# Altium schematic sheet MCU.SchDoc
size A4; SheetNumber: 3; SheetTotal: 6
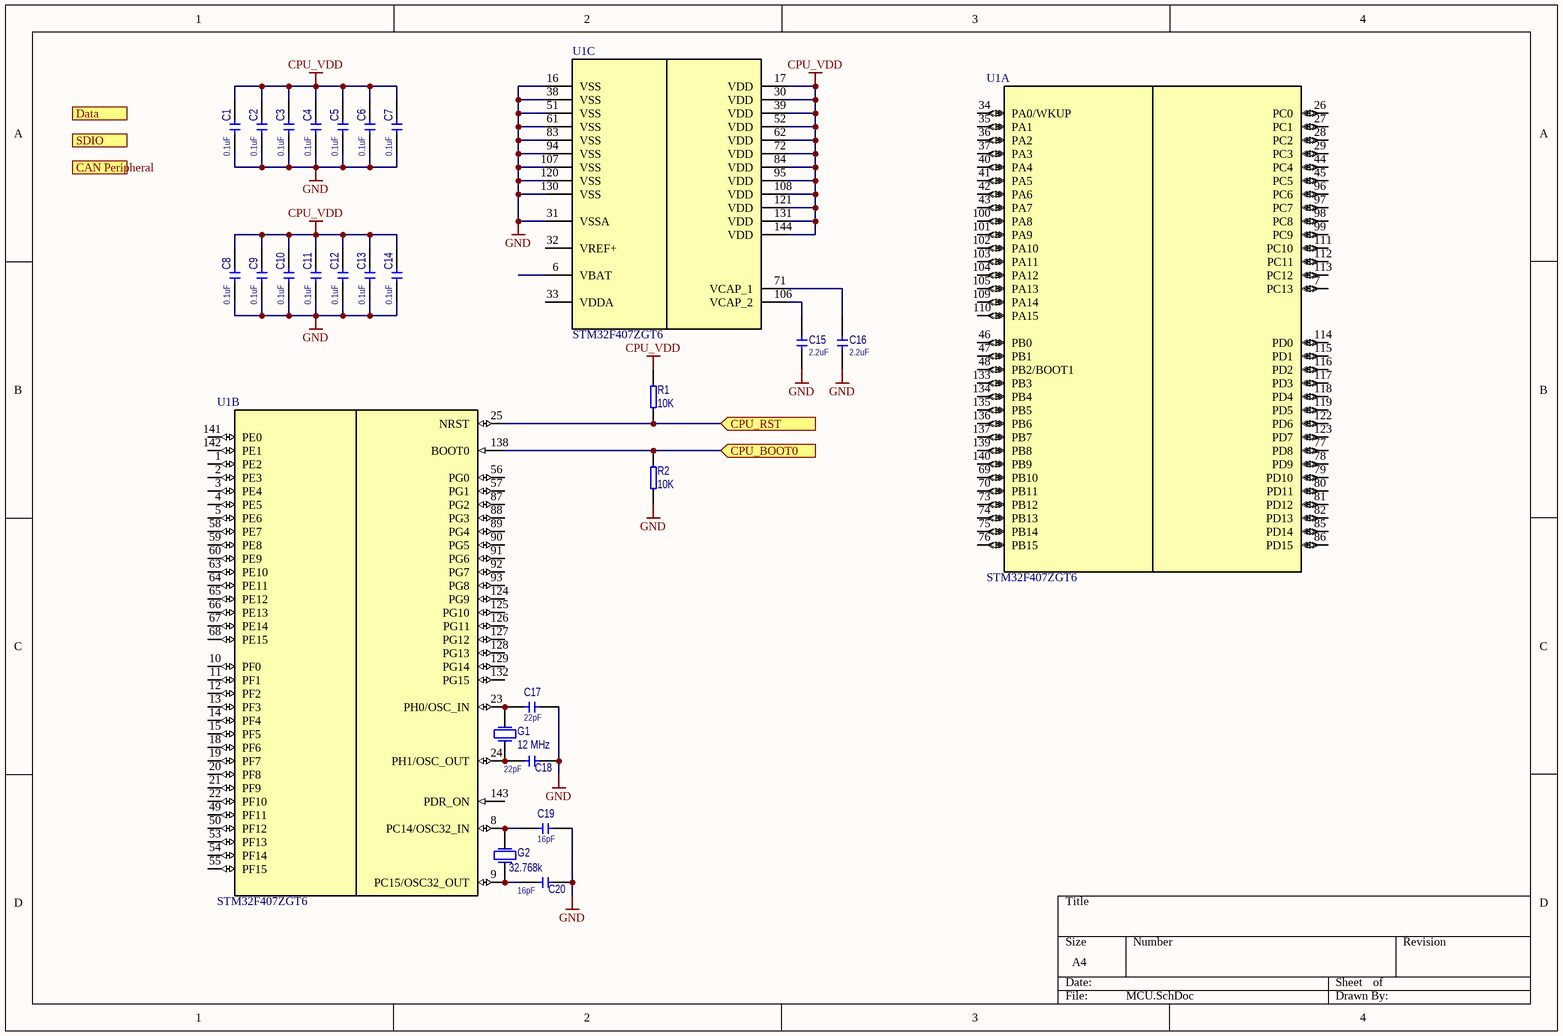
[diagram p0: MCU.SchDoc]

## Parts
C1  value 0.1uF  [CERCAP 0603]
C2  value 0.1uF  [CERCAP 0603]
C3  value 0.1uF  [CERCAP 0603]
C4  value 0.1uF  [CERCAP 0603]
C5  value 0.1uF  [CERCAP 0603]
C6  value 0.1uF  [CERCAP 0603]
C7  value 0.1uF  [CERCAP 0603]
C8  value 0.1uF  [CERCAP 0603]
C9  value 0.1uF  [CERCAP 0603]
C10  value 0.1uF  [CERCAP 0603]
C11  value 0.1uF  [CERCAP 0603]
C12  value 0.1uF  [CERCAP 0603]
C13  value 0.1uF  [CERCAP 0603]
C14  value 0.1uF  [CERCAP 0603]
C15  value 2.2uF  [CERCAP 0603]
C16  value 2.2uF  [CERCAP 0603]
C17  value 22pF  [CERCAP 0402]
C18  value 22pF  [CERCAP 0402]
C19  value 16pF  [CERCAP 0402]
C20  value 16pF  [CERCAP 0402]
G1  value 12 MHz  [3225]
G2  value 32.768k  [1210]
R1  value 10K  [RES 0402]
R2  value 10K  [RES 0402]
U1  STM32F407ZGT6  [LQFP-144]  (parts A,B,C of 3)

## Ports
CAN Peripheral, CPU_BOOT0 (in), CPU_RST (in), Data, SDIO

## Nets
CPU_VDD: C1.1 C2.1 C3.1 C4.1 C5.1 C6.1 C7.1 C8.1 C9.1 C10.1 C11.1 C12.1 C13.1 C14.1 R1.1 U1.17(VDD) U1.30(VDD) U1.39(VDD) U1.52(VDD) U1.62(VDD) U1.72(VDD) U1.84(VDD) U1.95(VDD) U1.108(VDD) U1.121(VDD) U1.131(VDD) U1.144(VDD)
GND: C1.2 C2.2 C3.2 C4.2 C5.2 C6.2 C7.2 C8.2 C9.2 C10.2 C11.2 C12.2 C13.2 C14.2 C15.2 C16.2 C17.2 C18.2 C19.2 C20.2 R2.1 U1.16(VSS) U1.31(VSSA) U1.38(VSS) U1.51(VSS) U1.61(VSS) U1.83(VSS) U1.94(VSS) U1.107(VSS) U1.120(VSS) U1.130(VSS)
CPU_BOOT0: R2.2 U1.138(BOOT0) ; port CPU_BOOT0
CPU_RST: R1.2 U1.25(NRST) ; port CPU_RST
NetC15_1: C15.1 U1.106(VCAP_2)
NetC16_1: C16.1 U1.71(VCAP_1)
NetC17_1: C17.1 G1.1 U1.23(PH0/OSC_IN)
NetC18_1: C18.1 G1.2 U1.24(PH1/OSC_OUT)
NetC19_1: C19.1 G2.1 U1.8(PC14/OSC32_IN)
NetC20_1: C20.1 G2.2 U1.9(PC15/OSC32_OUT)

Not connected (* = marked no-connect by the designer): U1 1(PE2) 2(PE3) 3(PE4) 4(PE5) 5(PE6) 6(VBAT) 7(PC13) 10(PF0) 11(PF1) 12(PF2) 13(PF3) 14(PF4) 15(PF5) 18(PF6) 19(PF7) 20(PF8) 21(PF9) 22(PF10) 26(PC0) 27(PC1) 28(PC2) 29(PC3) 32(VREF+) 33(VDDA) 34(PA0/WKUP) 35(PA1) 36(PA2) 37(PA3) 40(PA4) 41(PA5) 42(PA6) 43(PA7) 44(PC4) 45(PC5) 46(PB0) 47(PB1) 48(PB2/BOOT1) 49(PF11) 50(PF12) 53(PF13) 54(PF14) 55(PF15) 56(PG0) 57(PG1) 58(PE7) 59(PE8) 60(PE9) 63(PE10) 64(PE11) 65(PE12) 66(PE13) 67(PE14) 68(PE15) 69(PB10) 70(PB11) 73(PB12) 74(PB13) 75(PB14) 76(PB15) 77(PD8) 78(PD9) 79(PD10) 80(PD11) 81(PD12) 82(PD13) 85(PD14) 86(PD15) 87(PG2) 88(PG3) 89(PG4) 90(PG5) 91(PG6) 92(PG7) 93(PG8) 96(PC6) 97(PC7) 98(PC8) 99(PC9) 100(PA8) 101(PA9) 102(PA10) 103(PA11) 104(PA12) 105(PA13) 109(PA14) 110(PA15) 111(PC10) 112(PC11) 113(PC12) 114(PD0) 115(PD1) 116(PD2) 117(PD3) 118(PD4) 119(PD5) 122(PD6) 123(PD7) 124(PG9) 125(PG10) 126(PG11) 127(PG12) 128(PG13) 129(PG14) 132(PG15) 133(PB3) 134(PB4) 135(PB5) 136(PB6) 137(PB7) 139(PB8) 140(PB9) 141(PE0) 142(PE1) 143(PDR_ON)

## Library data of the parts
C1-C20 = !Capacitor: Capacitor; IsSMT: NoSMT; Diel: X7R; Voltage: *
G1 = Crystal: pin to pad: 2>3; IsSMT: NoSMT
G2 = Crystal: IsSMT: NoSMT
R1 R2 = !Resistor: Resistor; IsSMT: NoSMT
U1 = STM32F407ZGT6: Coretx-M4